# Altium schematic sheet TopLevel.SchDoc
size A; SheetNumber: 1; SheetTotal: 8
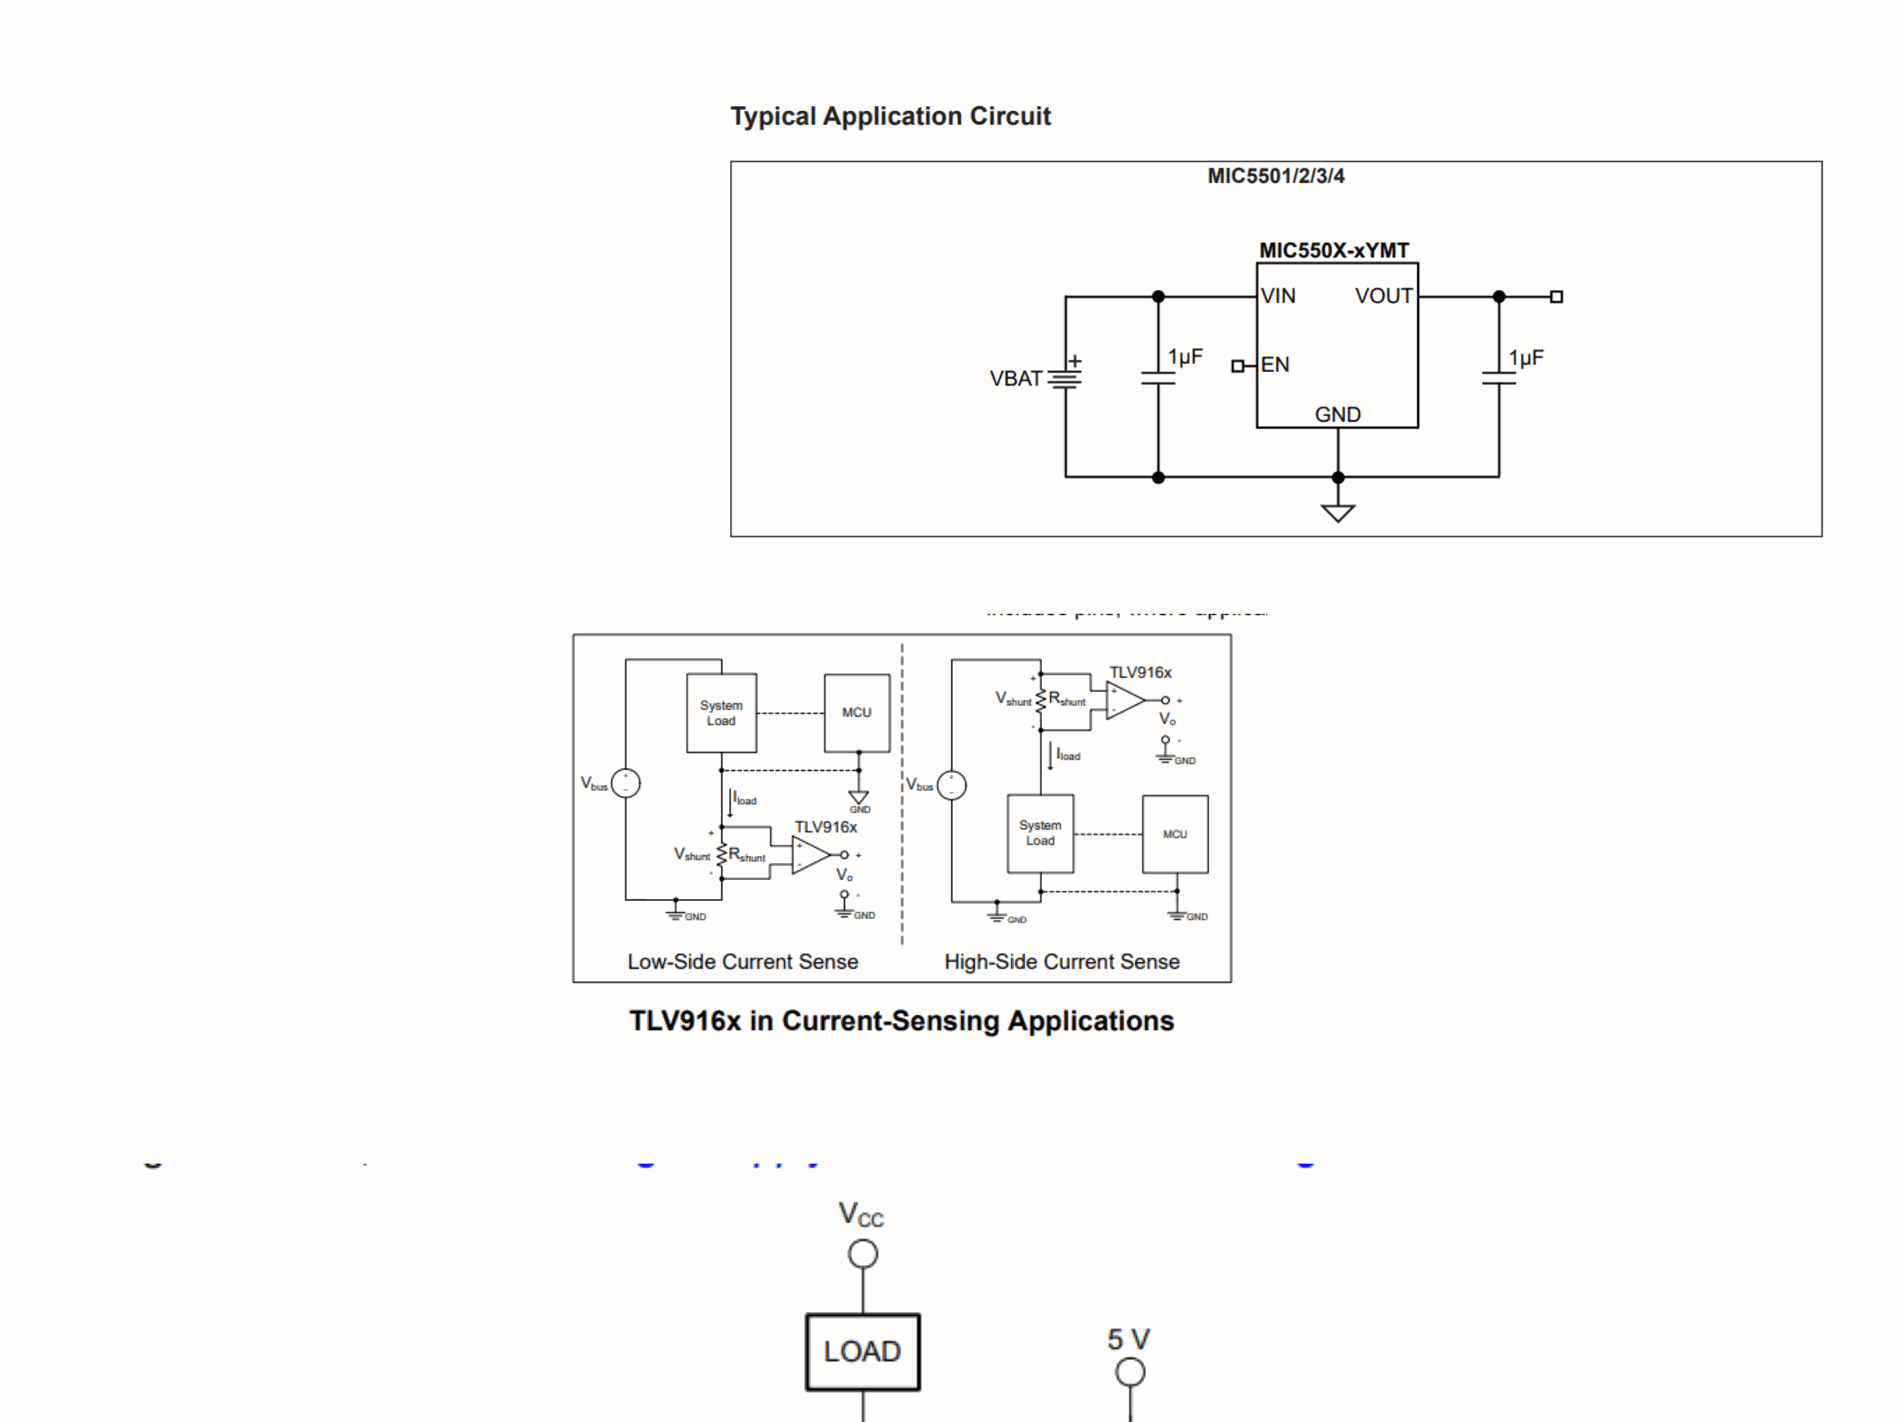
[diagram p0: TopLevel.SchDoc, top column 1 of 4]
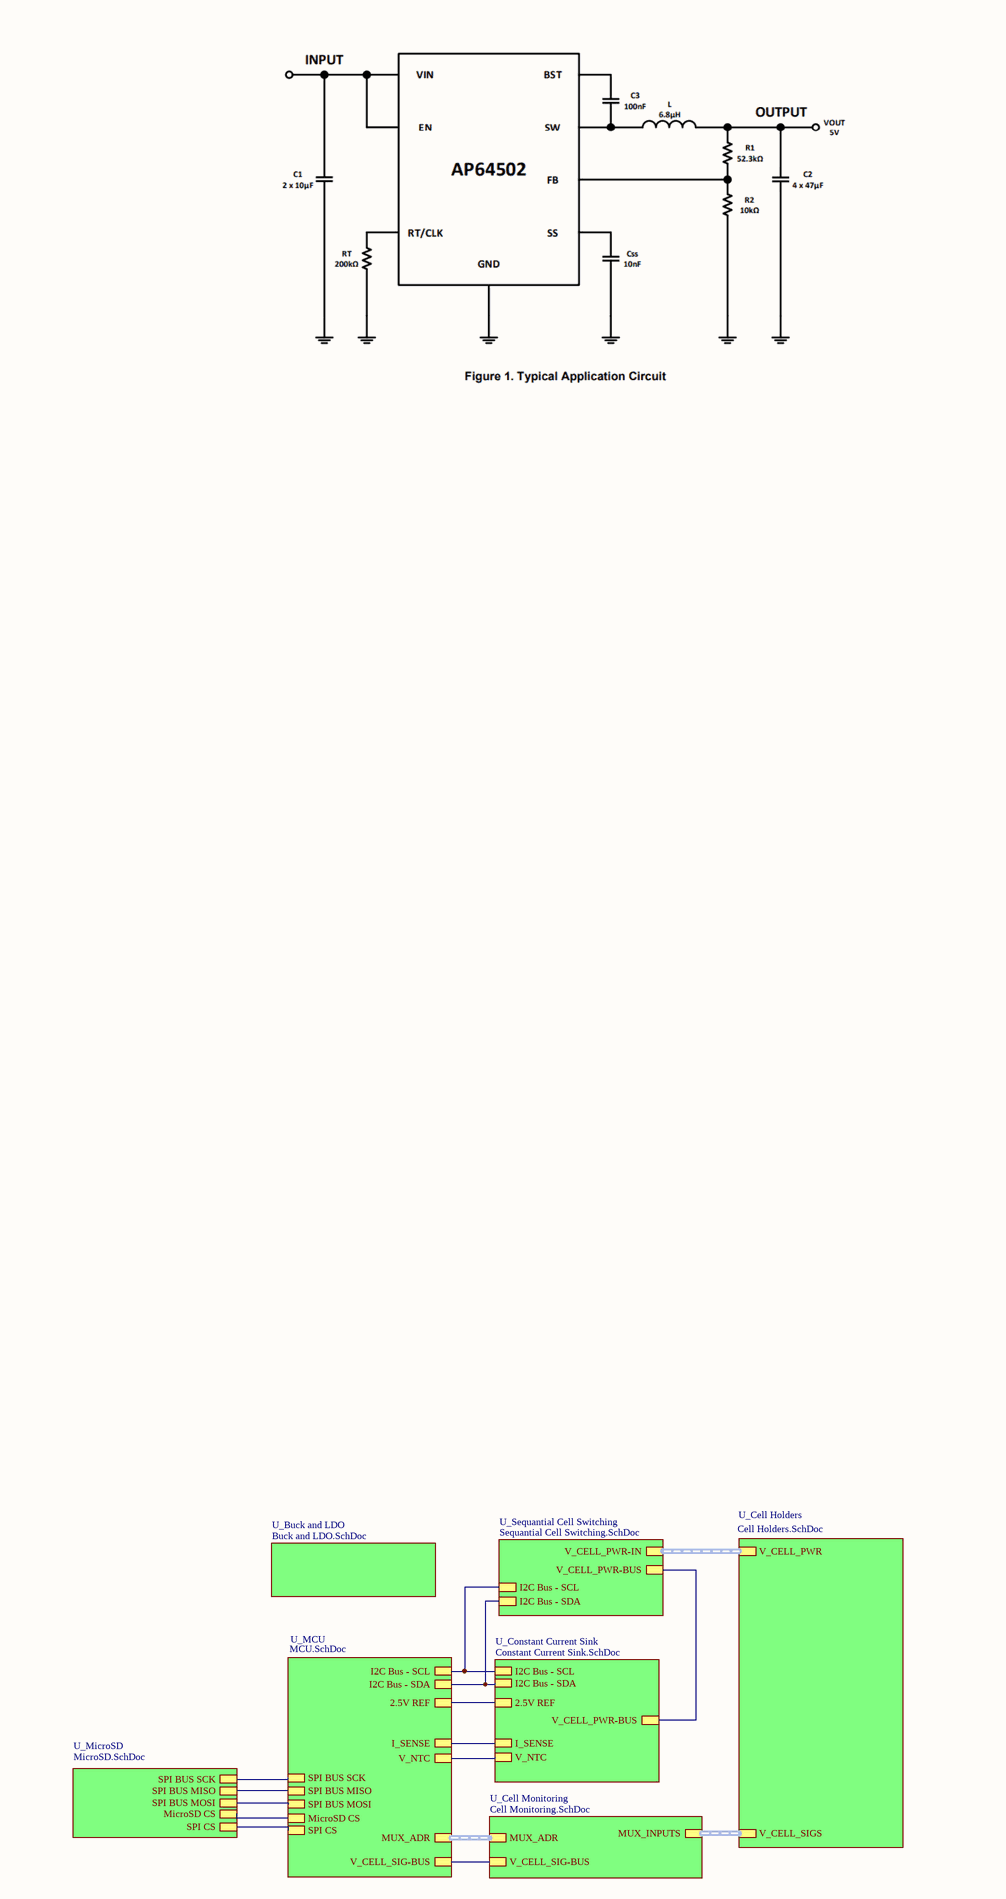
[diagram p1: TopLevel.SchDoc, top column 2 of 4]
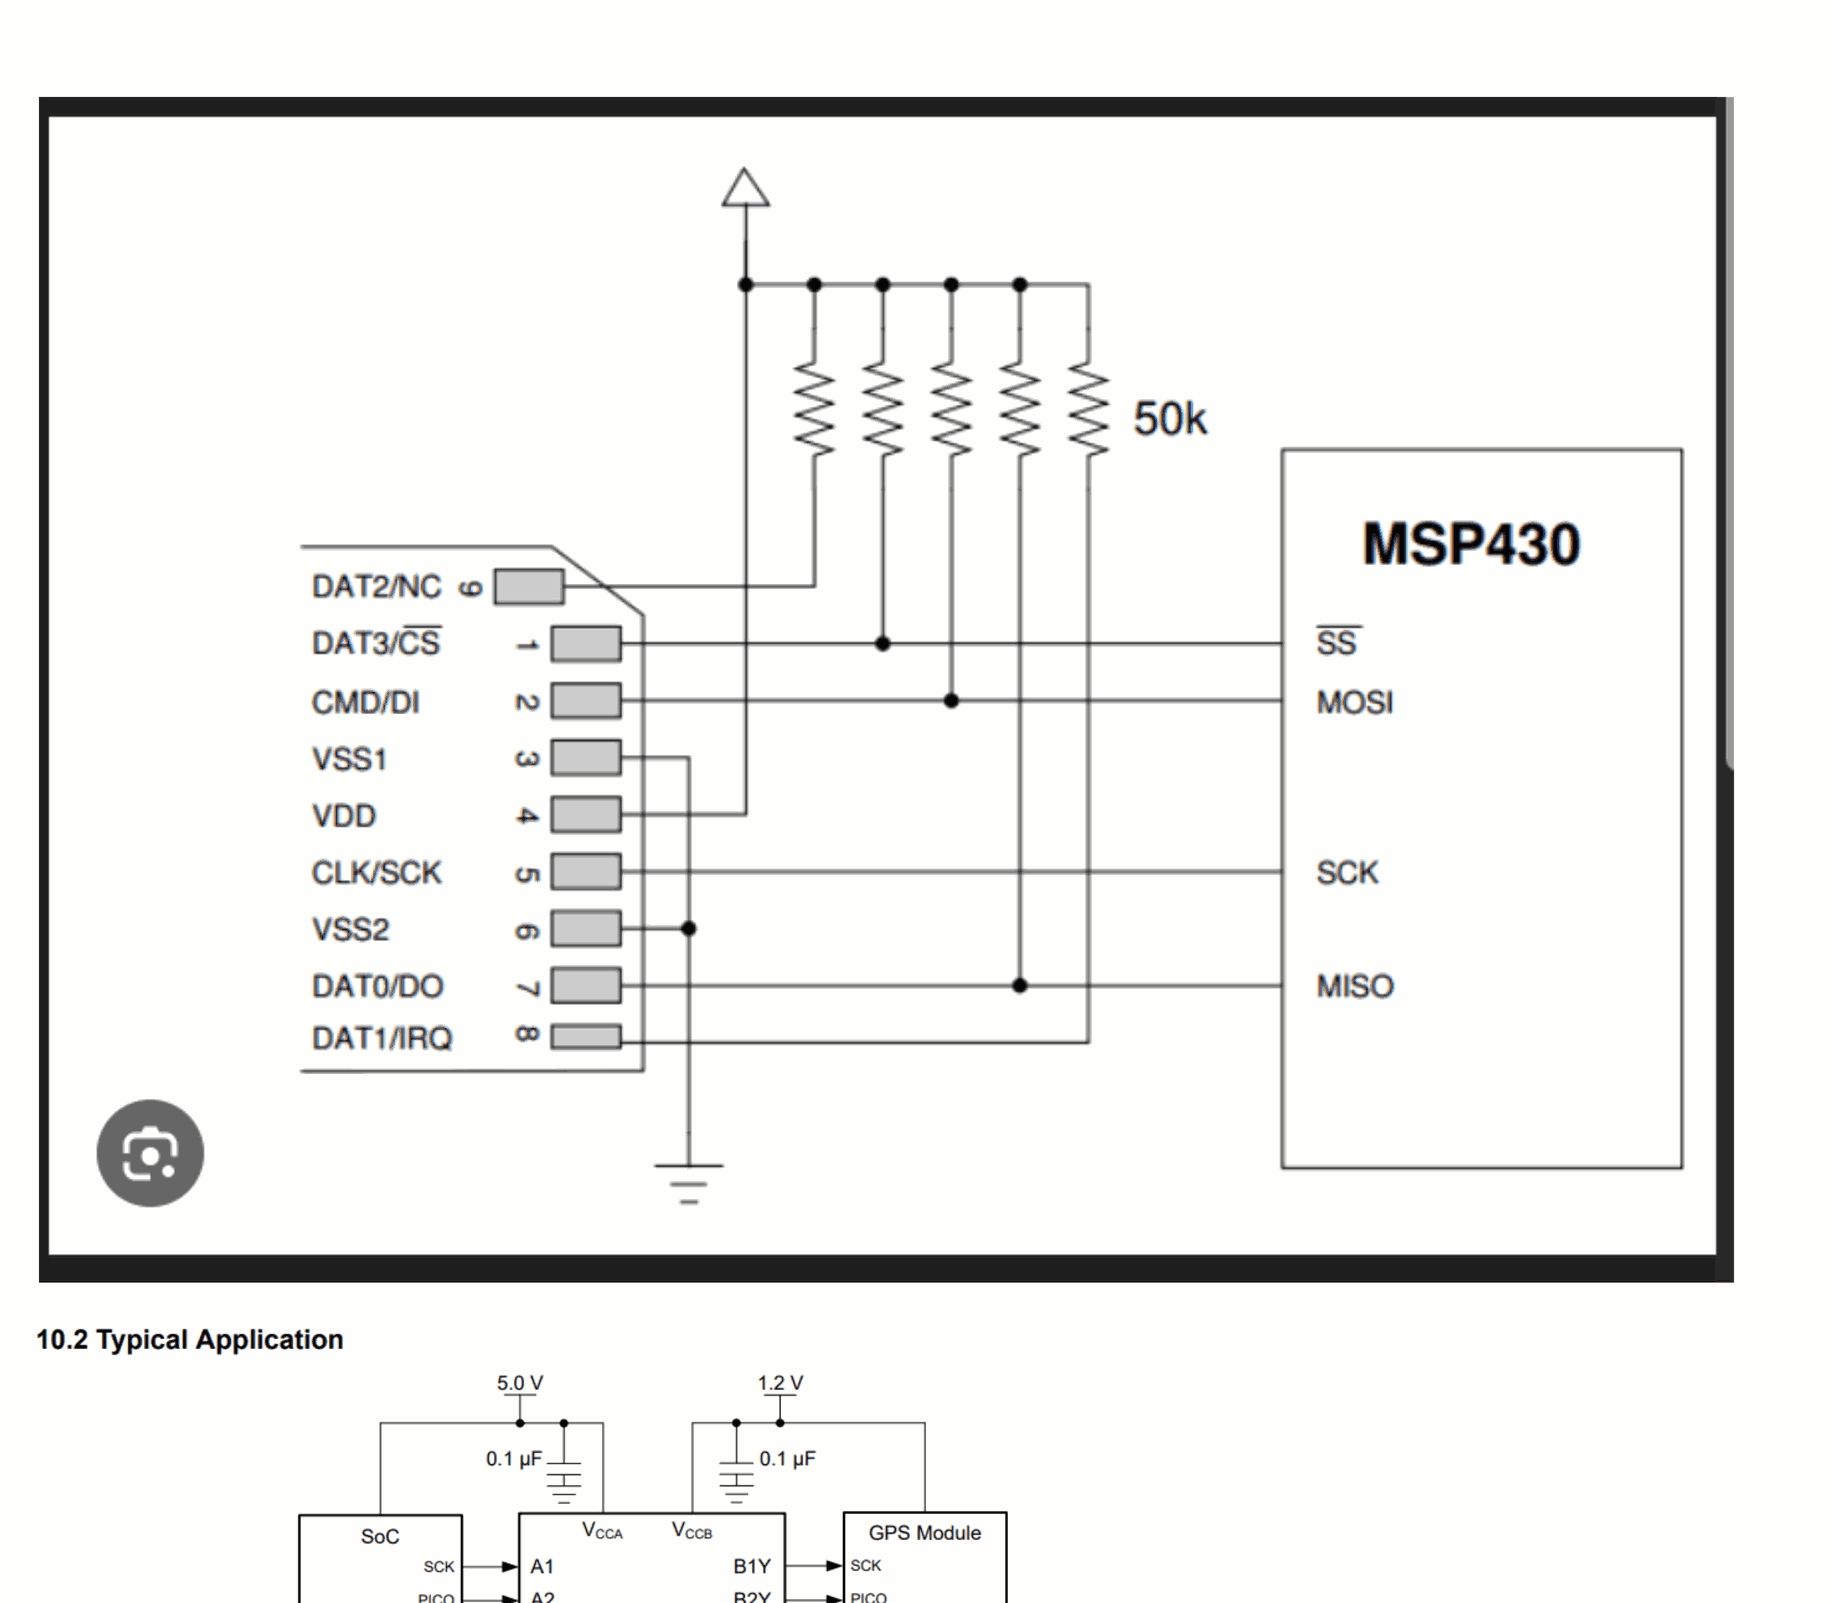
[diagram p2: TopLevel.SchDoc, top column 4 of 4]
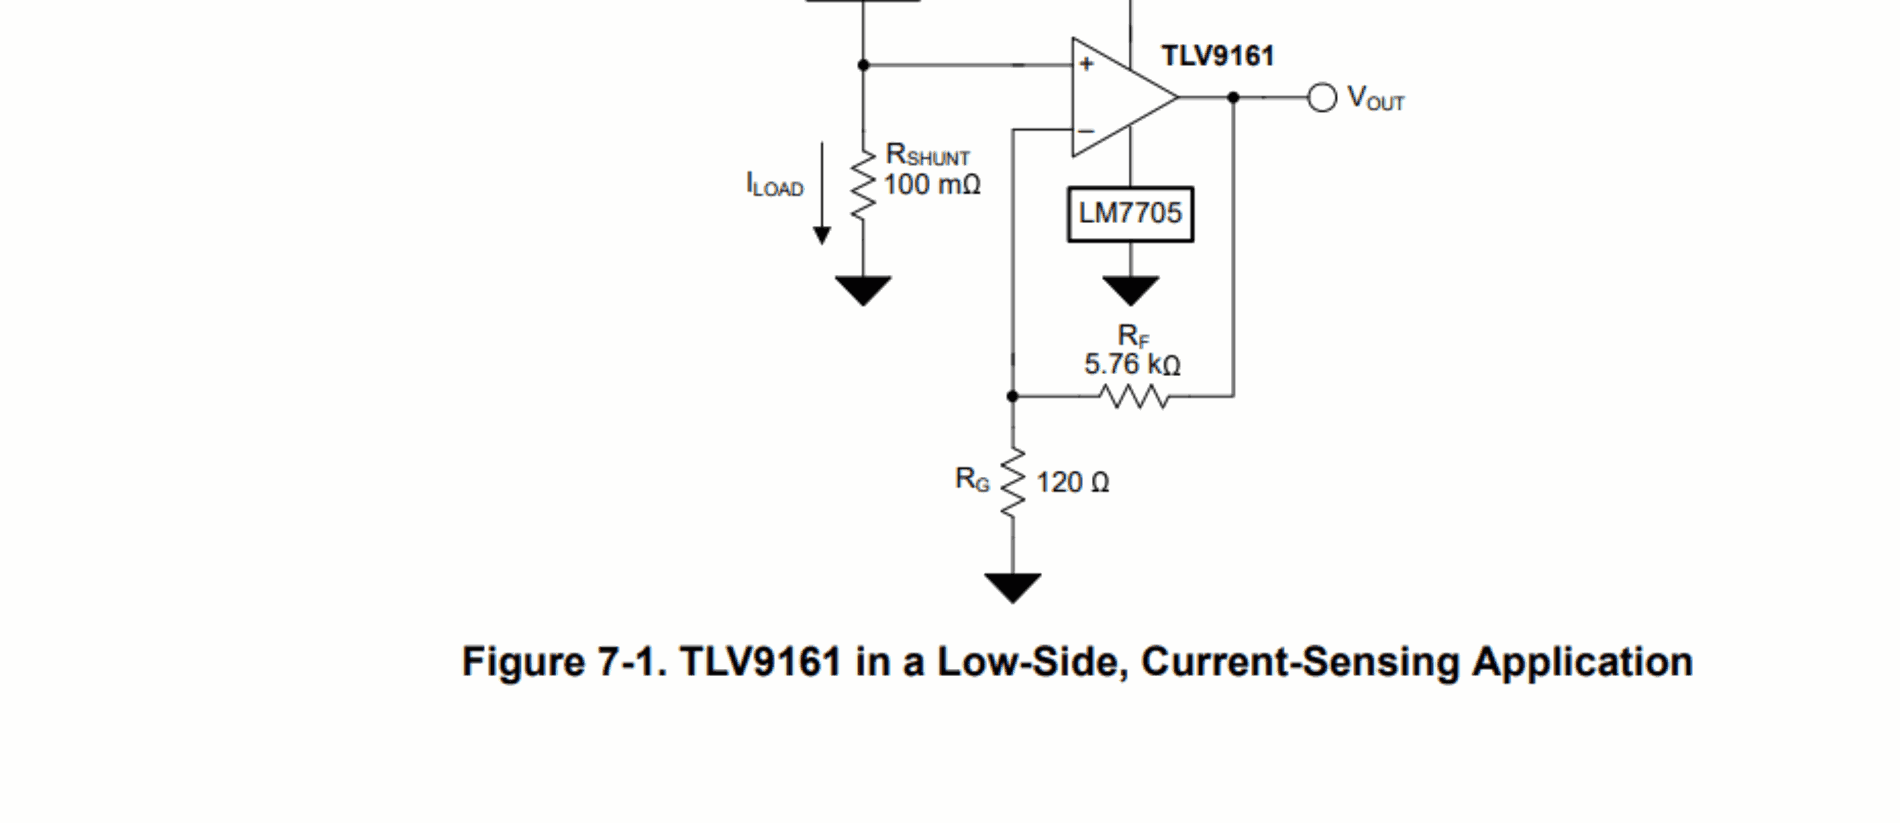
[diagram p3: TopLevel.SchDoc, centre column 1 of 4]
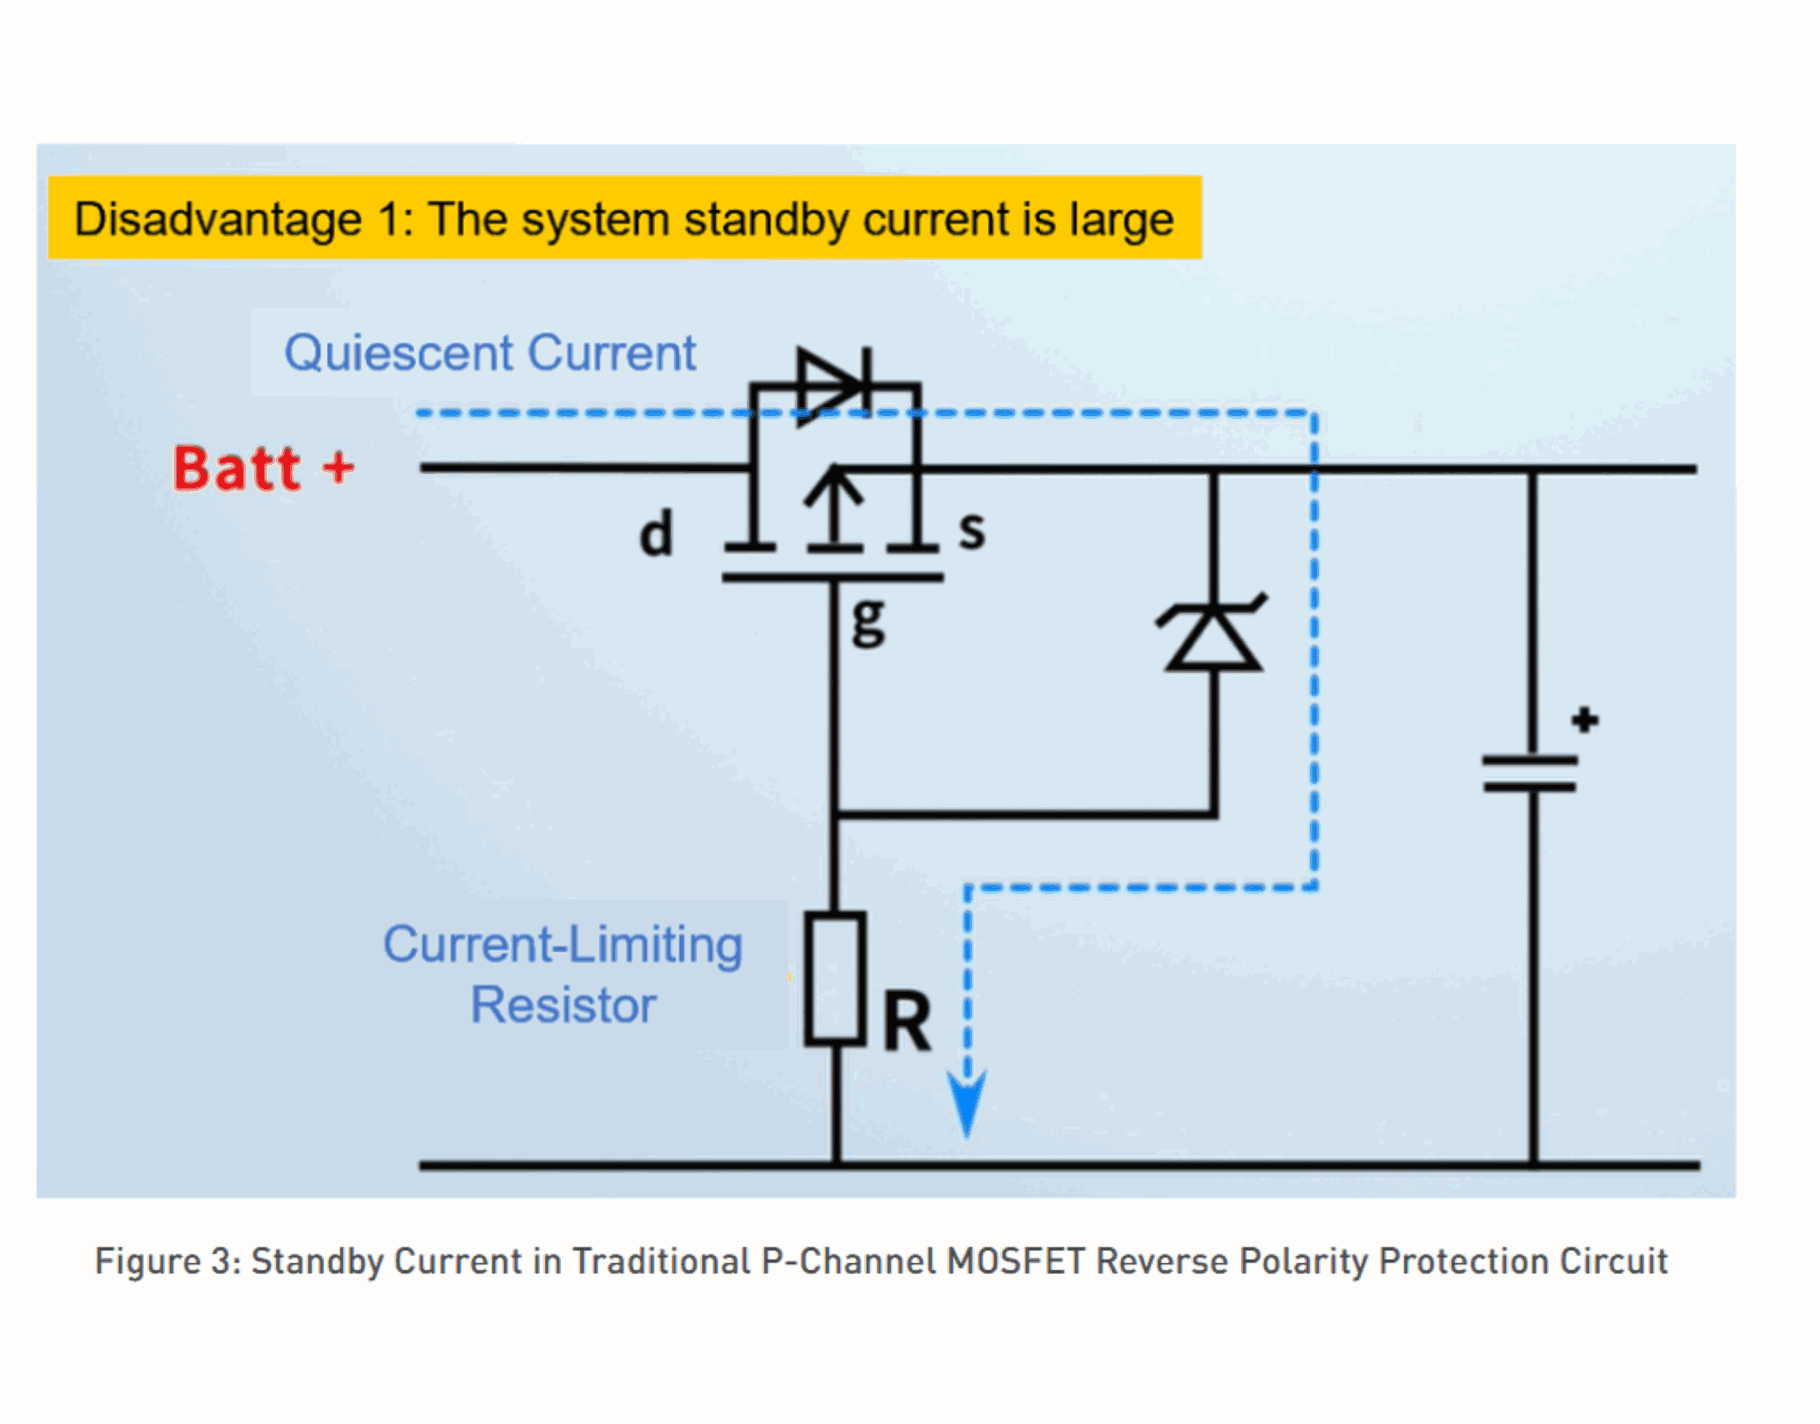
[diagram p4: TopLevel.SchDoc, centre column 2 of 4]
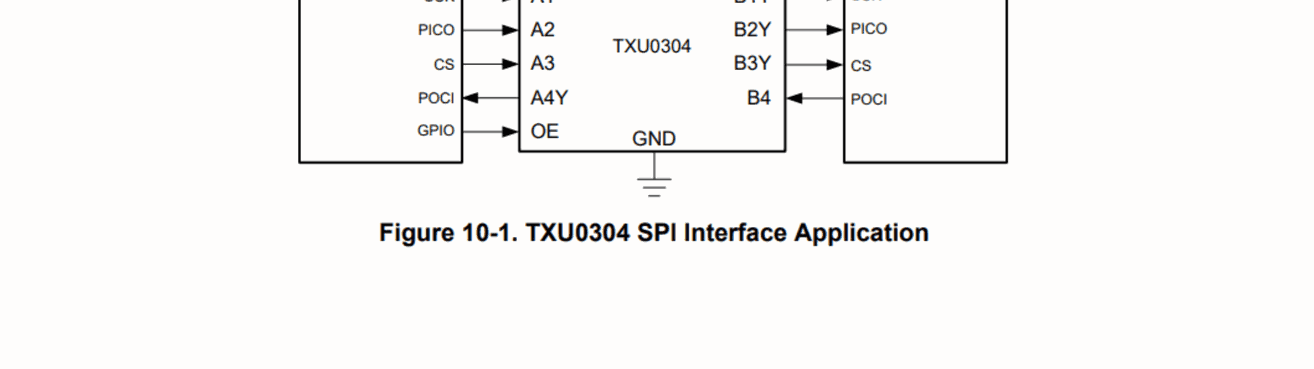
[diagram p5: TopLevel.SchDoc, centre column 4 of 4]

## Sub-sheets
U_Buck and LDO = Buck and LDO.SchDoc: no entries
U_Cell Holders = Cell Holders.SchDoc: V_CELL_SIGS (harness CELL_SIGS), V_CELL_PWR (harness CELL_PWR)
U_Cell Monitoring = Cell Monitoring.SchDoc: V_CELL_SIG-BUS, MUX_INPUTS (harness CELL_SIGS), MUX_ADR (harness MUX_ADR)
U_Constant Current Sink = Constant Current Sink.SchDoc: I2C Bus - SCL, I2C Bus - SDA, 2.5V REF, I_SENSE, V_NTC, V_CELL_PWR-BUS
U_MCU = MCU.SchDoc: SPI CS, 2.5V REF, MicroSD CS, SPI BUS MOSI, V_CELL_SIG-BUS, SPI BUS MISO, SPI BUS SCK, I2C Bus - SDA, I2C Bus - SCL, I_SENSE, V_NTC, MUX_ADR (harness MUX_ADR)
U_MicroSD = MicroSD.SchDoc: SPI CS, SPI BUS SCK, SPI BUS MISO, SPI BUS MOSI, MicroSD CS
U_Sequantial Cell Switching = Sequantial Cell Switching.SchDoc: I2C Bus - SCL, I2C Bus - SDA, V_CELL_PWR-BUS, V_CELL_PWR-IN (harness CELL_PWR)

## Nets
(unnamed): sheet U_Cell Monitoring/V_CELL_SIG-BUS, sheet U_MCU/V_CELL_SIG-BUS
(unnamed): sheet U_Constant Current Sink/I2C Bus - SCL, sheet U_MCU/I2C Bus - SCL, sheet U_Sequantial Cell Switching/I2C Bus - SCL
(unnamed): sheet U_Constant Current Sink/I2C Bus - SDA, sheet U_MCU/I2C Bus - SDA, sheet U_Sequantial Cell Switching/I2C Bus - SDA
(unnamed): sheet U_Constant Current Sink/2.5V REF, sheet U_MCU/2.5V REF
(unnamed): sheet U_Constant Current Sink/I_SENSE, sheet U_MCU/I_SENSE
(unnamed): sheet U_Constant Current Sink/V_NTC, sheet U_MCU/V_NTC
(unnamed): sheet U_Constant Current Sink/V_CELL_PWR-BUS, sheet U_Sequantial Cell Switching/V_CELL_PWR-BUS
(unnamed): sheet U_MCU/SPI CS, sheet U_MicroSD/SPI CS
(unnamed): sheet U_MCU/MicroSD CS, sheet U_MicroSD/MicroSD CS
(unnamed): sheet U_MCU/SPI BUS MOSI, sheet U_MicroSD/SPI BUS MOSI
(unnamed): sheet U_MCU/SPI BUS MISO, sheet U_MicroSD/SPI BUS MISO
(unnamed): sheet U_MCU/SPI BUS SCK, sheet U_MicroSD/SPI BUS SCK

## Buses and harness runs
harness sheet U_Cell Holders/V_CELL_PWR = sheet U_Sequantial Cell Switching/V_CELL_PWR-IN
harness sheet U_Cell Holders/V_CELL_SIGS = sheet U_Cell Monitoring/MUX_INPUTS
harness sheet U_Cell Monitoring/MUX_ADR = sheet U_MCU/MUX_ADR